# EAGLE design rpilink222 (EAGLE 7.1.0)
Raspberry Pi Link Adaptor v2.22, Copyright (C) 2014 Hessel Schut
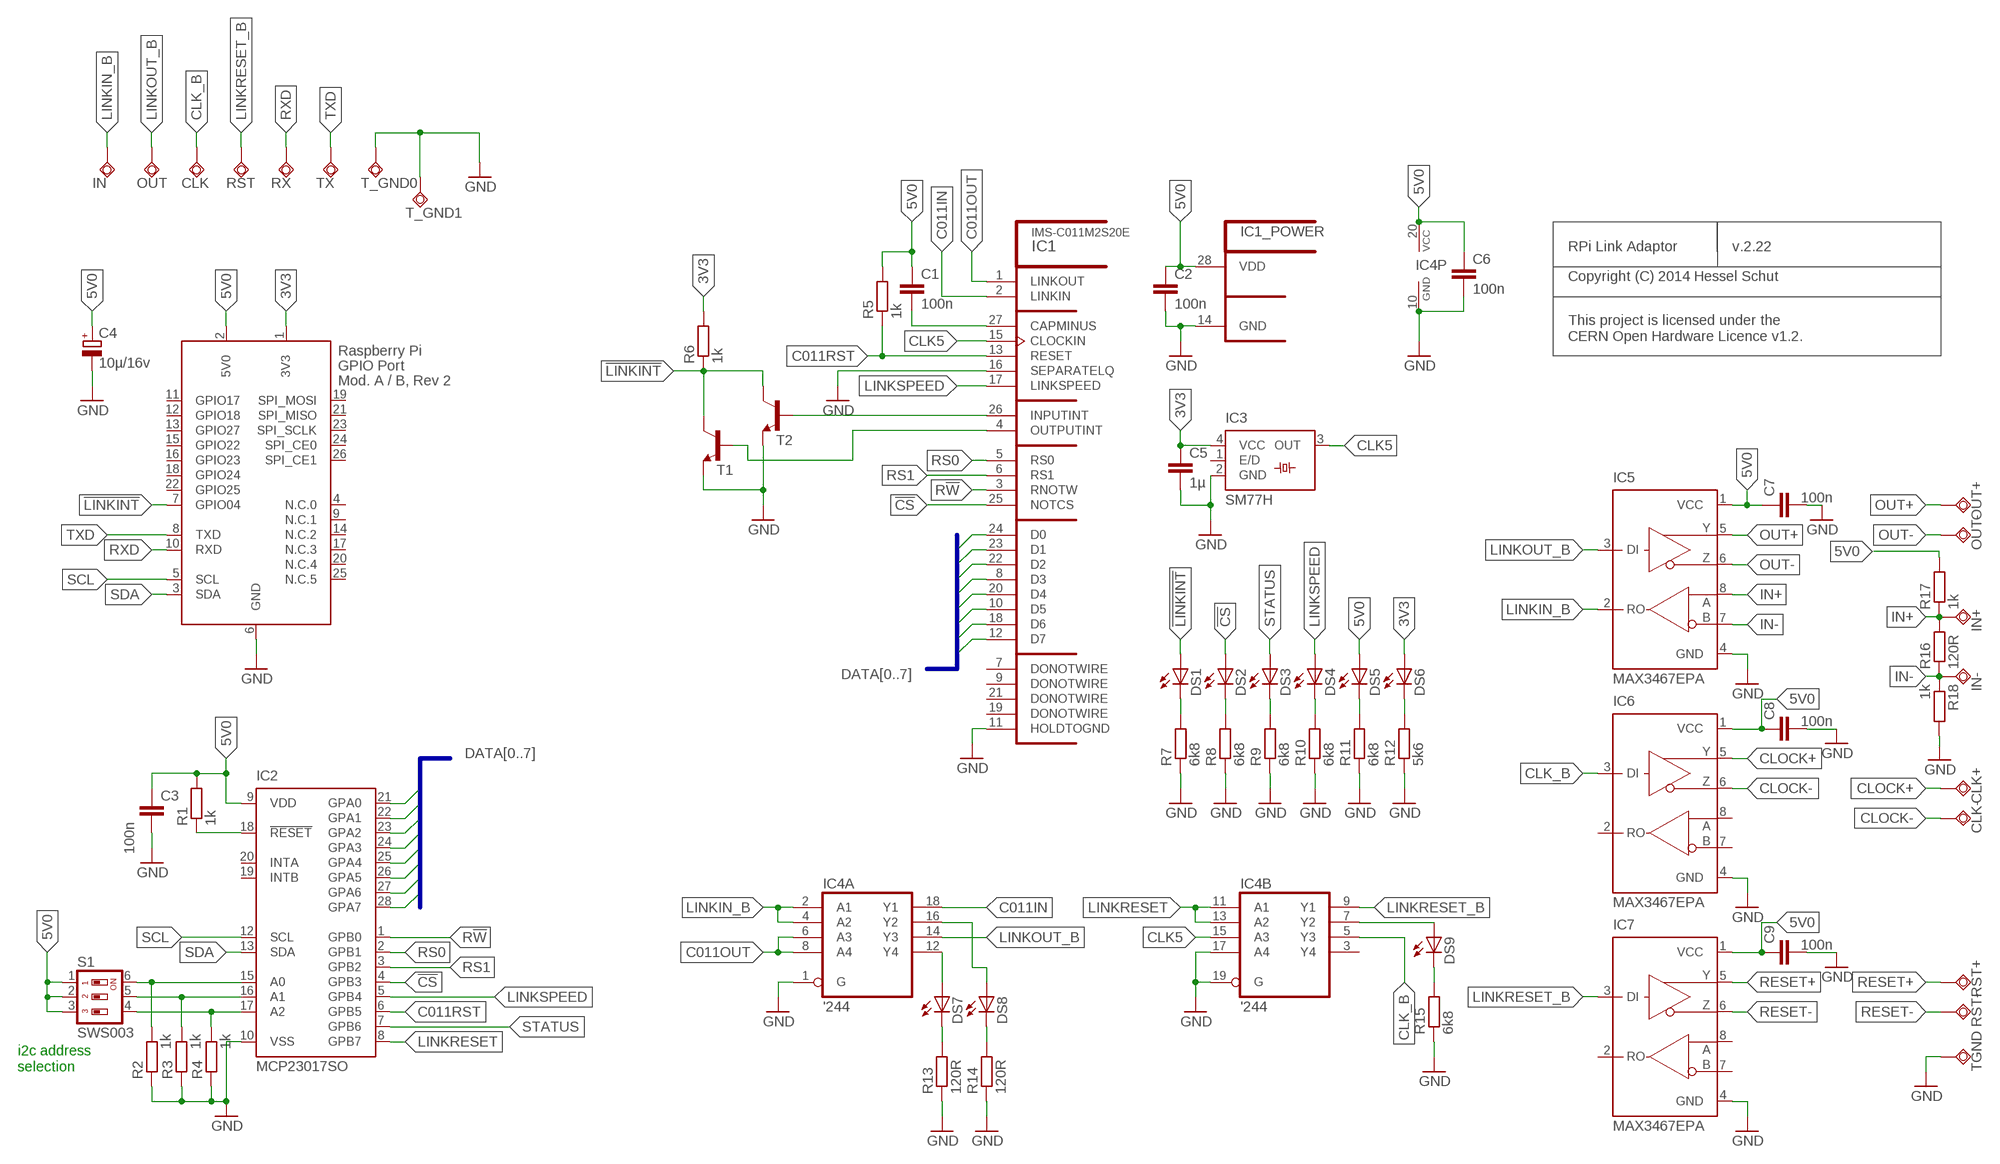
[diagram p0: schematic, sheet 1]

## Parts
C1  100n  C-EUC0805  [C0805]
C2  100n  C-EUC0805  [C0805]
C3  100n  C-EUC0805  [C0805]
C4  10µ/16v  CPOL-EUC/6032-28R  [C/6032-28R]
C5  1µ  C-EUC0805  [C0805]
C6  100n  C-EUC0805  [C0805]
C7  100n  C-EUC0805  [C0805]
C8  100n  C-EUC0805  [C0805]
C9  100n  C-EUC0805  [C0805]
CLK  TPSQTP20SQ  [TP20SQ]
CLK+  TPSQTP20SQ  [TP20SQ]
CLK-  TPSQTP20SQ  [TP20SQ]
DS1  LEDCHIP-LED0603  [CHIP-LED0603]
DS2  LEDCHIP-LED0603  [CHIP-LED0603]
DS3  LEDCHIP-LED0603  [CHIP-LED0603]
DS4  LEDCHIP-LED0603  [CHIP-LED0603]
DS5  LEDCHIP-LED0603  [CHIP-LED0603]
DS6  LEDCHIP-LED0603  [CHIP-LED0603]
DS7  LEDCHIP-LED0603  [CHIP-LED0603]
DS8  LEDCHIP-LED0603  [CHIP-LED0603]
DS9  LEDCHIP-LED0603  [CHIP-LED0603]
IC1  IMS-C011M2S20E  [SOJ28-3]
IC2  MCP23017SO  [SO28W]
IC3  SM77H  [SM77H]
IC4  '244  74AC244DW  [SO20W]
IC5  MAX3467EPA  [SO08]
IC6  MAX3467EPA  [SO08]
IC7  MAX3467EPA  [SO08]
IN  TPSQTP20SQ  [TP20SQ]
IN+  TPSQTP20SQ  [TP20SQ]
IN-  TPSQTP20SQ  [TP20SQ]
OUT  TPSQTP20SQ  [TP20SQ]
OUT+  TPSQTP20SQ  [TP20SQ]
OUT-  TPSQTP20SQ  [TP20SQ]
R1  1k  R-EU_R0603  [R0603]
R2  1k  R-EU_R0603  [R0603]
R3  1k  R-EU_R0603  [R0603]
R4  1k  R-EU_R0603  [R0603]
R5  1k  R-EU_R0603  [R0603]
R6  1k  R-EU_R0603  [R0603]
R7  6k8  R-EU_R0603  [R0603]
R8  6k8  R-EU_R0603  [R0603]
R9  6k8  R-EU_R0603  [R0603]
R10  6k8  R-EU_R0603  [R0603]
R11  6k8  R-EU_R0603  [R0603]
R12  5k6  R-EU_R0603  [R0603]
R13  120R  R-EU_R0603  [R0603]
R14  120R  R-EU_R0603  [R0603]
R15  6k8  R-EU_R0603  [R0603]
R16  120R  R-EU_R0603  [R0603]
R17  1k  R-EU_R0603  [R0603]
R18  1k  R-EU_R0603  [R0603]
RST  TPSQTP20SQ  [TP20SQ]
RST+  TPSQTP20SQ  [TP20SQ]
RST-  TPSQTP20SQ  [TP20SQ]
RX  TPSQTP20SQ  [TP20SQ]
S1  SWS003  [SMS-003]
T1  BC808-NPN-SOT23-BEC  [SOT23-BEC]
T2  BC808-NPN-SOT23-BEC  [SOT23-BEC]
T_GND0  TPSQTP20SQ  [TP20SQ]
T_GND1  TPSQTP20SQ  [TP20SQ]
TGND  TPSQTP20SQ  [TP20SQ]
TX  TPSQTP20SQ  [TP20SQ]
X1  RASPI_BOARD_AB_E2P  [RASPI_BOARD_AB_EDGES_2DRILL_PAD]

## Nets
3V3: C5.1 DS6.A IC3.4(VCC) R6.2 X1.1(3V3)
5V0: C1.1 C2.1 C3.1 C4.+ C6.1 C7.1 C8.1 C9.1 DS5.A IC1.28(VDD) IC2.9(VDD) IC4.20(P:VCC) IC5.1(VCC) IC6.1(VCC) IC7.1(VCC) R1.2 R5.2 R17.2 S1.1 S1.2 S1.3 X1.2(5V0)
!CS: DS2.A IC1.25(NOTCS) IC2.4(GPB3)
!LINKINT: DS1.A R6.1 T1.C T2.C X1.7(GPIO04)
C011IN: IC1.2(LINKIN) IC4.18(A:Y1)
C011OUT: IC1.1(LINKOUT) IC4.6(A:A3) IC4.8(A:A4)
C011RST: IC1.13(RESET) IC2.6(GPB5) R5.1
CLK5: IC1.15(CLOCKIN) IC3.3(OUT) IC4.15(B:A3)
CLK_B: CLK.TP IC4.5(B:Y3) IC6.3(DI)
CLOCK+: CLK+.TP IC6.5(Y)
CLOCK-: CLK-.TP IC6.6(Z)
DATA0: IC1.24(D0) IC2.21(GPA0)
DATA1: IC1.23(D1) IC2.22(GPA1)
DATA2: IC1.22(D2) IC2.23(GPA2)
DATA3: IC1.8(D3) IC2.24(GPA3)
DATA4: IC1.20(D4) IC2.25(GPA4)
DATA5: IC1.10(D5) IC2.26(GPA5)
DATA6: IC1.18(D6) IC2.27(GPA6)
DATA7: IC1.12(D7) IC2.28(GPA7)
GND: C2.2 C3.2 C4.- C5.2 C6.2 C7.2 C8.2 C9.2 IC1.11(HOLDTOGND) IC1.14(GND) IC1.16(SEPARATELQ) IC2.10(VSS) IC3.2(GND) IC4.1(A:G) IC4.10(P:GND) IC4.17(B:A4) IC4.19(B:G) IC5.4(GND) IC6.4(GND) IC7.4(GND) R2.1 R3.1 R4.1 R7.1 R8.1 R9.1 R10.1 R11.1 R12.1 R13.1 R14.1 R15.1 R18.2 T1.E T2.E T_GND0.TP T_GND1.TP TGND.TP X1.6(GND)
IN+: IC5.8(A) IN+.TP R16.2 R17.1
IN-: IC5.7(B) IN-.TP R16.1 R18.1
LINKIN_B: IC4.2(A:A1) IC4.4(A:A2) IC5.2(RO) IN.TP
LINKOUT_B: IC4.14(A:Y3) IC5.3(DI) OUT.TP
LINKRESET: IC2.8(GPB7) IC4.11(B:A1) IC4.13(B:A2)
LINKRESET_B: IC4.9(B:Y1) IC7.3(DI) RST.TP
LINKSPEED: DS4.A IC1.17(LINKSPEED) IC2.5(GPB4)
N$1: IC2.18(!RESET) R1.1
N$2: IC2.15(A0) R2.2 S1.6
N$3: C1.2 IC1.27(CAPMINUS)
N$4: IC2.16(A1) R3.2 S1.5
N$5: IC2.17(A2) R4.2 S1.4
N$6: IC1.26(INPUTINT) T2.B
N$7: IC1.4(OUTPUTINT) T1.B
N$8: DS7.C R13.2
N$9: DS8.C R14.2
N$10: DS7.A IC4.12(A:Y4)
N$11: DS1.C R7.2
N$12: DS2.C R8.2
N$13: DS3.C R9.2
N$14: DS4.C R10.2
N$15: DS5.C R11.2
N$16: DS6.C R12.2
N$17: DS8.A IC4.16(A:Y2)
N$19: DS9.A IC4.7(B:Y2)
N$20: DS9.C R15.2
OUT+: IC5.5(Y) OUT+.TP
OUT-: IC5.6(Z) OUT-.TP
R!W: IC1.3(RNOTW) IC2.1(GPB0)
RESET+: IC7.5(Y) RST+.TP
RESET-: IC7.6(Z) RST-.TP
RS0: IC1.5(RS0) IC2.2(GPB1)
RS1: IC1.6(RS1) IC2.3(GPB2)
RXD: RX.TP X1.10(RXD)
SCL: IC2.12(SCL) X1.5(SCL)
SDA: IC2.13(SDA) X1.3(SDA)
STATUS: DS3.A IC2.7(GPB6)
TXD: TX.TP X1.8(TXD)
Unconnected: IC1.7(DONOTWIRE) IC1.9(DONOTWIRE) IC1.19(DONOTWIRE) IC1.21(DONOTWIRE) IC2.19(INTB) IC2.20(INTA) IC3.1(E/D) IC4.3(B:Y4) IC6.2(RO) IC6.7(B) IC6.8(A) IC7.2(RO) IC7.7(B) IC7.8(A) X1.4(N.C.0) X1.9(N.C.1) X1.11(GPIO17) X1.12(GPIO18) X1.13(GPIO27) X1.14(N.C.2) X1.15(GPIO22) X1.16(GPIO23) X1.17(N.C.3) X1.18(GPIO24) X1.19(SPI_MOSI) X1.20(N.C.4) X1.21(SPI_MISO) X1.22(GPIO25) X1.23(SPI_SCLK) X1.24(SPI_CE0) X1.25(N.C.5) X1.26(SPI_CE1)

## Buses
DATA[0..7]

## Notes on the sheet
- RPi Link Adaptor | v.2.22
- Copyright (C) 2014 Hessel Schut
- This project is licensed under the 
  CERN Open Hardware Licence v1.2.
- i2c address
  selection

## Library data of the parts
C1-C3 C5-C9 = rcl:C-EU: CAPACITOR, European symbol
C4 = rcl:CPOL-EU: POLARIZED CAPACITOR, European symbol
CLK CLK+ CLK- IN IN+ IN- OUT OUT+ OUT- RST RST+ RST- RX T_GND0 T_GND1 TGND TX = testpad:TPSQ: Test pad
DS1-DS9 = led:LED: LED OSRAM: - CHIPLED LG R971, LG N971, LY N971, LG Q971, LY Q971, LO R971, LY R971 LH N974, LH R974 LS Q976, LO Q976, LY Q976 LO Q996 - Hyper CHIPLED LW Q18S LB Q993, LB Q99A, LB R99A - SideLED LS A670, LO A670, LY A670, LG A670, LP A670 LB A673, LV A673, LT A673, LW A673 LH A674 LY A675 LS A676, LA A676, LO A676, LY A676, LW A676 LS A679, LY A679, LG A679 - Hyper Micro SIDELED® LS Y876, LA Y876, LO Y876, LY Y876 LT Y87S - SmartLED LW L88C, LW L88S LB L89C, LB L89S, LG L890 LS L89K, LO L89K, LY L89K LS L896, LA L896, LO L896, LY L896 - TOPLED LS T670, LO T670, LY T670, LG T670, LP T670 LSG T670, LSP T670, LSY T670, LOP T670, LYG T670 LG T671, LOG T671, LSG T671 LB T673, LV T673, LT T673, LW T673 LH T674 LS T676, LA T676, LO T676, LY T676, LB T676, LH T676, LSB T676, LW T676 LB T67C, LV T67C, LT T67C, LS T67K, LO T67K, LY T67K, LW E67C LS E67B, LA E67B, LO E67B, LY E67B, LB E67C, LV E67C, LT E67C LW T67C LS T679, LY T679, LG T679 LS T770, LO T770, LY T770, LG T770, LP T770 LB T773, LV T773, LT T773, LW T773 LH T774 LS E675, LA E675, LY E675, LS T675 LS T776, LA T776, LO T776, LY T776, LB T776 LHGB T686 LT T68C, LB T68C - Hyper Mini TOPLED® LB M676 - Mini TOPLED Santana® LG M470 LS M47K, LO M47K, LY M47K Source: http://www.osram.convergy.de LUXEON: - LUMILED® LXK2-PW12-R00, LXK2-PW12-S00, LXK2-PW14-U00, LXK2-PW14-V00 LXK2-PM12-R00, LXK2-PM12-S00, LXK2-PM14-U00 LXK2-PE12-Q00, LXK2-PE12-R00, LXK2-PE12-S00, LXK2-PE14-T00, LXK2-PE14-U00 LXK2-PB12-K00, LXK2-PB12-L00, LXK2-PB12-M00, LXK2-PB14-N00, LXK2-PB14-P00, LXK2-PB14-Q00 LXK2-PR12-L00, LXK2-PR12-M00, LXK2-PR14-Q00, LXK2-PR14-R00 LXK2-PD12-Q00, LXK2-PD12-R00, LXK2-PD12-S00 LXK2-PH12-R00, LXK2-PH12-S00 LXK2-PL12-P00, LXK2-PL12-Q00, LXK2-PL12-R00 Source: www.luxeon.com KINGBRIGHT: KA-3528ASYC Source: www.kingbright.com
IC1 = Transputers:IMS-C011M2: C011 peripheral mode 2 INMOS link adaptor in operation mode 2. Source: The Transputer Databook 1992 INMOS/SGS-Thomson Arto Kyyhkynen, artoky@dlc.fi
IC2 = microchip:MCP23017: http://ww1.microchip.com/downloads/en/DeviceDoc/21952a.pdf Source: http://ww1.microchip.com/downloads/en/DeviceDoc/21952a.pdf; MF: MICROCHIP; MPN: MCP23017-E/SO; OC_FARNELL: 1332087; OC_NEWARK: 31K2958
IC3 = crystal:SM77H: 3.3V CMOS Clock Oscillator Source: www.pletronics.com .. sm77h%203.3v.pdf; OC_FARNELL: unknown; OC_NEWARK: unknown
IC4 = 74xx-eu:74*244: Octal BUFFER and LINE DRIVER, 3-state
IC5-IC7 = maxim:MAX3467*: +5V, Fail-Safe, 40Mbps, Profibus RS-485/RS-422 Transceivers Source: MAX3465-MAX3469.pdf; OC_FARNELL: unknown; OC_NEWARK: unknown
R1-R18 = rcl:R-EU_: RESISTOR, European symbol
S1 = smd-special:SWS003: SMD Dip Switch 3 pol.
T1 T2 = transistor:*-NPN-: NPN Transistror BF959 corrected 2008.03.06
X1 = raspberrypi_bastelstube_v13:RASPI_BOARD_AB: Raspberry Pi GPIO connector with markings for the outer dimensions of the Raspberry Pi board model A or B with different sets of drill holes or mounting pads for model B Revision 2.0

## Board
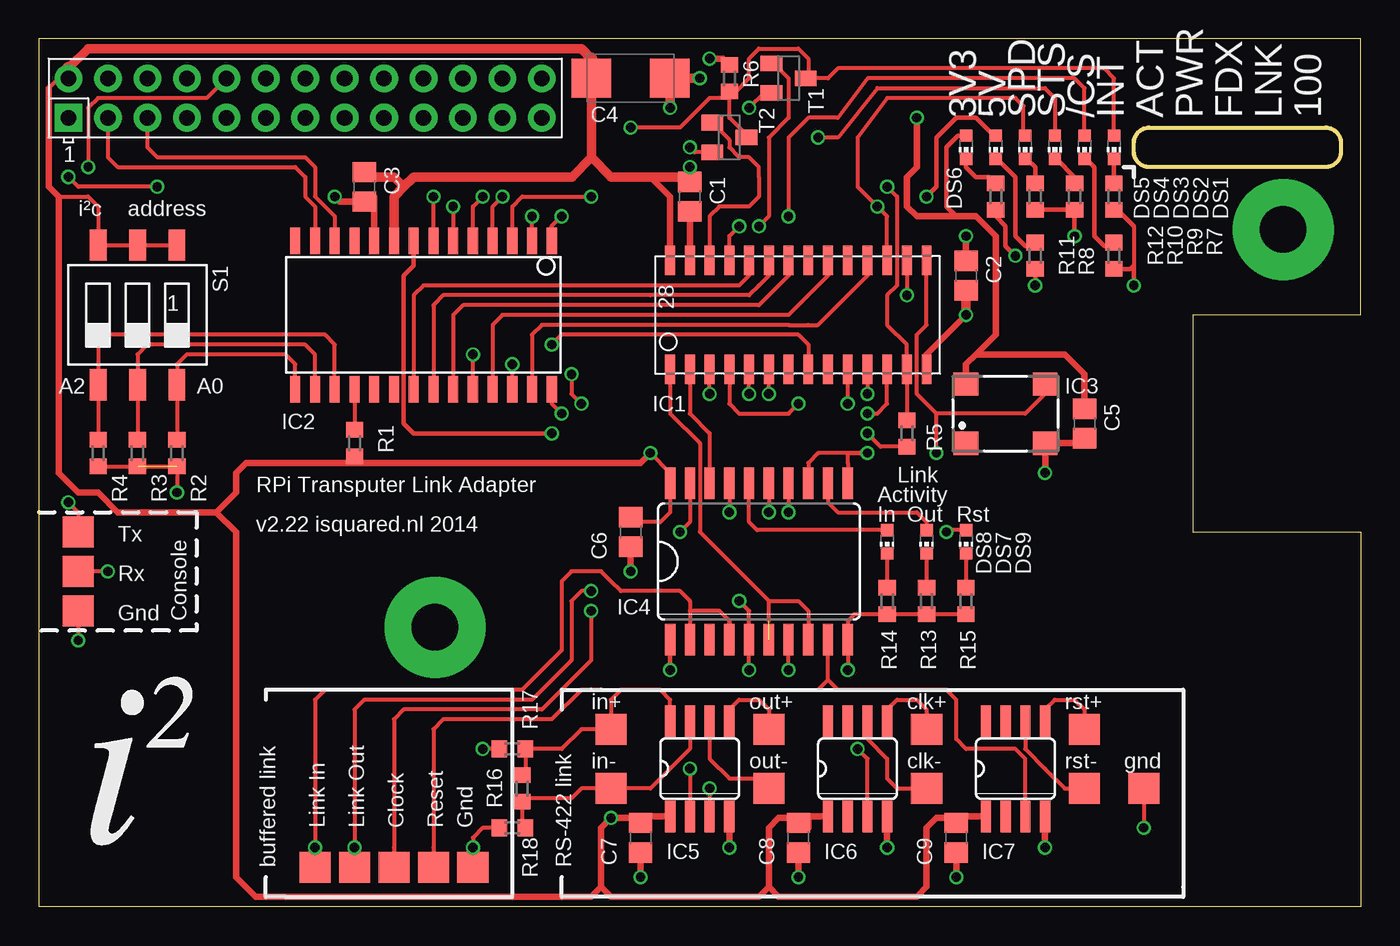
[diagram p1: board, top side]
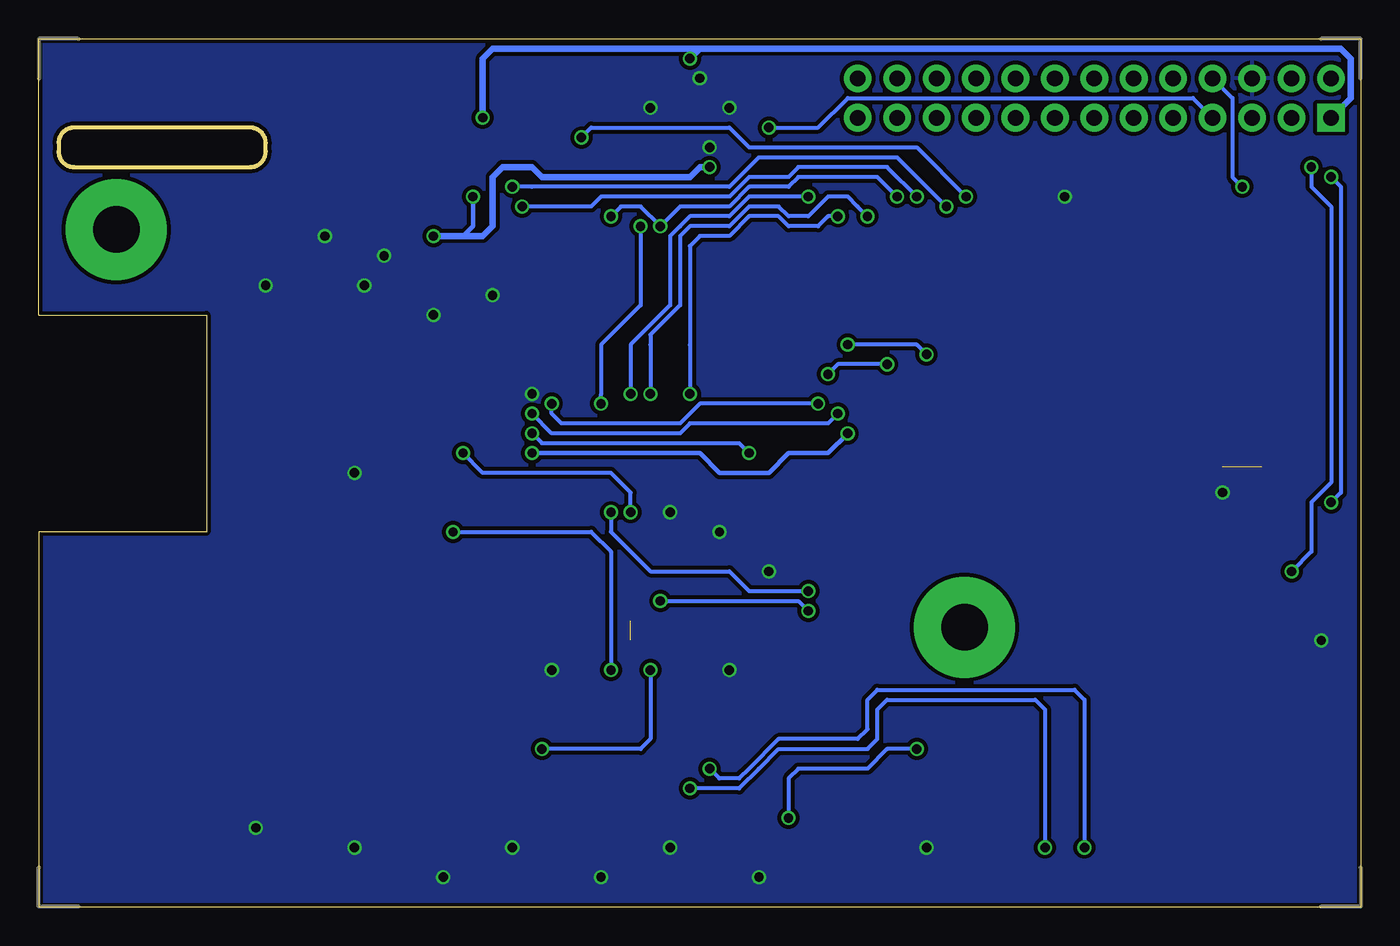
[diagram p2: board, bottom side, seen from below]

Size 85.09 x 55.88 mm. Coordinates in mm from the lower left corner, seen from the top.
Outline: 0,55.87 0,0 85.09,0 85.09,24.13 84.45,24.13 74.3,24.13 74.3,38.1 85.09,38.1 85.09,55.88 0,55.88
Outline: 71.48,50.16 82.82,50.16 arc-90 83.82,49.16 83.82,48.62 arc-90 82.82,47.62 71.48,47.62 arc-90 70.48,48.62 70.48,49.16 arc-90 71.48,50.16
Copper layers (1*16): Top 0.035mm / dielectric 1.5mm / Bottom 0.035mm
Design rules "dirt_cheap_dirty_boards.v1": minimum track width 5mil, minimum drill 12mil, track to track 5mil, track to pad 5mil, pad to pad 5mil, via to via 5mil, smd to smd 0mil, copper to edge 10mil, drill to drill 10mil, minimum pad ring 10mil, minimum via ring 6mil, stop-mask expansion 2mil, vias tented up to drill 25mil, thermal gap 10mil

### Footprints (pad centres in the part's own frame; a part is rotated, then mirrored left to right if it is on the bottom)
C0805 = smd 1.3 x 1.5: 1 -0.95,0; 2 0.95,0
C/6032-28R = smd 2.55 x 2.5: + 2.525,0; - -2.525,0
TP20SQ = smd 2 x 2: TP 0,0
CHIP-LED0603 = smd 0.8 x 0.8: A 0,-0.75; C 0,0.75
SOJ28-3 = smd 0.635 x 1.905: 1 -7.62,-3.505; 2 -6.35,-3.505; 3 -5.08,-3.505; 4 -3.81,-3.505; 5 -2.54,-3.505; 6 -1.27,-3.505; 7 0,-3.505; 8 1.27,-3.505; 9 2.54,-3.505; 10 3.81,-3.505; 11 5.08,-3.505; 12 6.35,-3.505; 13 7.62,-3.505; 14 8.89,-3.505; 15 8.89,3.505; 16 7.62,3.505; 17 6.35,3.505; 18 5.08,3.505; 19 3.81,3.505; 20 2.54,3.505; 21 1.27,3.505; 22 0,3.505; 23 -1.27,3.505; 24 -2.54,3.505; 25 -3.81,3.505; 26 -5.08,3.505; 27 -6.35,3.505; 28 -7.62,3.505
SO28W = smd 0.65 x 1.7: 1 -7.62,-4.78; 2 -6.35,-4.78; 3 -5.08,-4.78; 4 -3.81,-4.78; 5 -2.54,-4.78; 6 -1.27,-4.78; 7 0,-4.78; 8 1.27,-4.78; 9 2.54,-4.78; 10 3.81,-4.78; 11 5.08,-4.78; 12 6.35,-4.78; 13 7.62,-4.78; 14 8.89,-4.78; 15 8.89,4.78; 16 7.62,4.78; 17 6.35,4.78; 18 5.08,4.78; 19 3.81,4.78; 20 2.54,4.78; 21 1.27,4.78; 22 0,4.78; 23 -1.27,4.78; 24 -2.54,4.78; 25 -3.81,4.78; 26 -5.08,4.78; 27 -6.35,4.78; 28 -7.62,4.78
SM77H = smd 1.6 x 1.5: 1 -2.55,-1.9; 2 2.55,-1.9; 3 2.55,1.9; 4 -2.55,1.9
SO20W = smd 0.66 x 2.032: 1 -5.715,-5.029; 2 -4.445,-5.029; 3 -3.175,-5.029; 4 -1.905,-5.029; 5 -0.635,-5.029; 6 0.635,-5.029; 7 1.905,-5.029; 8 3.175,-5.029; 9 4.445,-5.029; 10 5.715,-5.029; 11 5.715,5.029; 12 4.445,5.029; 13 3.175,5.029; 14 1.905,5.029; 15 0.635,5.029; 16 -0.635,5.029; 17 -1.905,5.029; 18 -3.175,5.029; 19 -4.445,5.029; 20 -5.715,5.029
SO08 = smd 0.66 x 2.032: 1 -1.905,-3.073; 2 -0.635,-3.073; 3 0.635,-3.073; 4 1.905,-3.073; 5 1.905,3.073; 6 0.635,3.073; 7 -0.635,3.073; 8 -1.905,3.073
R0603 = smd 1 x 1.1: 1 -0.85,0; 2 0.85,0
SMS-003 = smd 1.092 x 2.007: 1 -2.54,-4.496; 2 0,-4.496; 3 2.54,-4.496; 4 2.54,4.496; 5 0,4.496; 6 -2.54,4.496
SOT23-BEC = smd 1 x 1.4: B -0.95,-1.1; C 0,1.1; E 0.95,-1.1
RASPI_BOARD_AB_EDGES_2DRILL_PAD = drill 1 pad 1.778 square: 1 1.905,50.8 | drill 1 pad 1.778: 2 1.905,53.34; 3 4.445,50.8; 4 4.445,53.34; 5 6.985,50.8; 6 6.985,53.34; 7 9.525,50.8; 8 9.525,53.34; 9 12.065,50.8; 10 12.065,53.34; 11 14.605,50.8; 12 14.605,53.34; 13 17.145,50.8; 14 17.145,53.34; 15 19.685,50.8; 16 19.685,53.34; 17 22.225,50.8; 18 22.225,53.34; 19 24.765,50.8; 20 24.765,53.34; 21 27.305,50.8; 22 27.305,53.34; 23 29.845,50.8; 24 29.845,53.34; 25 32.385,50.8; 26 32.385,53.34 | drill 3 pad 6.5: DRILL_1 25.5,18; DRILL_2 80.1,43.6

### Placement (x,y rotation side)
C1  41.91,45.72 270 top
C2  59.69,40.64 270 top
C3  20.95,46.35 270 top
C4  38.1,53.34 180 top
C5  67.31,31.11 270 top
C6  38.1,24.13 270 top
C7  38.73,4.45 270 top
C8  48.9,4.45 270 top
C9  59.05,4.45 270 top
CLK  22.86,2.54 90 top
CLK+  57.15,11.43 0 top
CLK-  57.15,7.62 0 top
DS1  69.22,48.9 180 top
DS2  67.31,48.9 180 top
DS3  65.41,48.9 180 top
DS4  63.5,48.9 180 top
DS5  61.59,48.9 180 top
DS6  59.69,48.9 180 top
DS7  57.15,23.5 180 top
DS8  54.61,23.5 180 top
DS9  59.69,23.5 180 top
IC1  48.26,38.1 0 top
IC2  25.4,38.1 180 top
IC3  62.23,31.75 0 top
IC4  46.35,22.23 0 top
IC5  42.55,8.89 0 top
IC6  52.7,8.89 0 top
IC7  62.87,8.89 0 top
IN  17.78,2.54 90 top
IN+  36.83,11.43 0 top
IN-  36.83,7.62 0 top
OUT  20.32,2.54 90 top
OUT+  46.99,11.43 0 top
OUT-  46.99,7.62 0 top
R1  20.32,29.84 270 top
R2  8.89,29.21 90 top
R3  6.35,29.21 90 top
R4  3.81,29.21 90 top
R5  55.88,30.48 270 top
R6  44.45,53.34 90 top
R7  69.22,45.72 90 top
R8  69.22,41.91 90 top
R9  66.67,45.72 90 top
R10  64.14,45.72 90 top
R11  64.14,41.91 90 top
R12  61.59,45.72 90 top
R13  57.15,19.68 90 top
R14  54.61,19.68 90 top
R15  59.69,19.68 90 top
R16  31.11,7.62 90 top
R17  30.48,10.16 180 top
R18  30.48,5.08 180 top
RST  25.4,2.54 90 top
RST+  67.31,11.43 0 top
RST-  67.31,7.62 0 top
RX  2.54,21.59 270 top
S1  6.35,38.1 180 top
T1  48.26,53.34 270 top
T2  44.45,49.53 270 top
T_GND0  27.94,2.54 90 top
T_GND1  2.54,19.05 270 top
TGND  71.12,7.62 0 top
TX  2.54,24.13 270 top
U$1  [LOGOWOBLRG]  1.27,3.81 0 top
X1  0,0 0 top

### Tracks (layer width: path | path; a pad name or v marks a point on that pad's centre or on a via)
3V3  (via drill 0.6)
  Top 0.305: DS6.A 59.17,49.65 58.42,48.9 58.42,45.09 59.05,44.45
  Top 0.406: v43.18,54.61 44.03,54.61 R6.2 | C5.1 67.31,34.29 66.04,35.56 60.33,35.56 | 60.33,35.56 59.69,34.92 | 59.69,34.92 IC3.4 59.68,34.91 59.69,34.92 | 60.33,35.56 61.59,36.83 61.59,43.18 60.33,44.45 59.05,44.45 56.52,44.45 55.88,45.09 55.88,46.99 56.52,47.62 v56.52,50.8
  Bottom 0.406: X1.1 0.64,52.07 0.64,54.61 1.27,55.24 42.55,55.24 | 42.55,55.24 v43.18,54.61 | 42.55,55.24 55.88,55.24 56.52,54.61 v56.52,50.8
5V0  (via drill 0.6)
  Top 0.254: S1.3 S1.2 S1.1 | X1.2 1.27,53.34 0.64,52.7 | 3.76,42.55 S1.3 | 1.27,45.72 3.17,45.72 3.81,45.09 S1.3 | v39.37,29.21 40.64,27.94 IC4.20 40.64,25.4 40.01,24.77 38.41,24.77 C6.1 | R5.2 54.19,29.63 v53.34,30.48 | R1.2 20.32,29.21 20.32,28.57 | R17.2 v28.57,10.16
  Top 0.305: DS5.A 61.48,49.65 60.33,50.8 59.05,50.8 57.78,49.53 57.78,46.35 v57.15,45.72
  Top 0.406: 0.64,52.7 0.64,46.35 1.27,45.72 1.27,27.94 2.54,26.67 3.81,26.67 5.08,25.4 10.16,25.4 11.43,25.4 | v59.69,43.18 C2.1 | IC1.28 40.64,45.72 39.37,46.99 | 42.23,46.67 C1.1 v41.91,47.62 | 11.43,25.4 12.7,26.67 12.7,27.94 13.34,28.57 20.32,28.57 38.73,28.57 v39.37,29.21 | IC5.1 39.16,5.82 C7.1 38.73,5.71 v36.83,5.71 36.2,5.08 36.2,1.27 | IC6.1 49.32,5.82 | 49.32,5.82 C8.1 | 11.43,25.4 12.7,24.13 12.7,1.91 13.97,0.64 35.56,0.64 36.2,1.27 | 36.2,1.27 36.83,0.64 46.35,0.64 46.99,1.27 | 46.99,1.27 47.62,0.64 56.52,0.64 57.15,1.27 57.15,5.08 57.78,5.71 59.05,5.71 C9.1 59.48,5.82 IC7.1 | 46.99,1.27 46.99,5.08 47.62,5.71 49.53,5.71 49.53,5.08 49.32,5.29 49.32,5.82
  Top 0.61: 1.91,53.98 3.17,55.24 34.92,55.24 35.56,54.61 | C4.+ 35.58,48.24 | 35.58,48.24 36.83,46.99 39.37,46.99 41.59,46.99 C1.1 | IC2.9 22.86,45.72 23.5,46.35 | 23.5,46.35 24.13,46.99 34.32,46.99 35.58,48.24 | 23.5,46.35 22.86,46.99 21.27,46.99 C3.1
  Top 0.813: X1.2 1.91,53.98 | 35.56,54.61 35.56,53.35 C4.+
  Bottom 0.254: v53.34,30.48 52.7,29.84 40.01,29.84 v39.37,29.21 | v36.83,5.71 36.83,8.26 36.2,8.89 31.75,8.89 30.48,10.16 v28.57,10.16
  Bottom 0.305: v57.15,45.72 57.15,43.81 57.78,43.18
  Bottom 0.406: v59.69,43.18 57.78,43.18 56.52,43.18 55.88,43.81 55.88,46.99 55.24,47.62 53.34,47.62 52.7,46.99 43.18,46.99 42.55,47.62 v41.91,47.62
!CS  (via drill 0.6)
  Top 0.254: IC2.4 29.21,45.09 v29.84,45.72 | IC1.25 44.45,43.18 v45.09,43.81 | v48.26,44.45 48.26,49.53 49.53,50.8 51.44,50.8 53.34,53.34 66.67,53.34 67.31,52.7 DS2.A
  Bottom 0.254: v29.84,45.72 31.11,46.99 36.2,46.99 36.83,46.35 39.37,46.35 40.64,45.09 43.81,45.09 v45.09,43.81 46.35,45.09 47.62,45.09 v48.26,44.45
!LINKINT  (via drill 0.6)
  Top 0.254: T2.C 45.55,49.7 44.45,50.8 44.45,52.07 | 44.45,52.07 R6.1 44.87,52.49 45.72,53.34 45.72,54.61 46.35,55.24 48.9,55.24 49.53,54.61 49.53,53.51 T1.C | 44.45,52.07 43.18,52.07 41.27,50.16 v38.1,50.16 | DS1.A 69.22,53.34 68.58,53.98 51.44,53.98 50.8,53.34 T1.C | 49.53,53.17 T1.C
  Bottom 0.254: v38.1,50.16 34.92,50.16 33.02,52.07 10.79,52.07 X1.7
C011IN
  Top 0.254: IC1.2 41.91,31.75 43.18,30.48 IC4.18
C011OUT  (1 unrouted)
  Top 0.254: IC1.1 40.64,31.75 42.55,29.84 42.55,24.13 46.99,19.68 | 46.99,18.41 46.99,19.68 | 46.99,19.68 48.9,19.68 49.53,19.05 IC4.8
C011RST  (via drill 0.6)
  Top 0.254: R5.1 IC1.13 55.88,36.2 54.61,37.47 54.61,39.37 55.24,40.01 55.24,45.72 v54.61,46.35 | v26.67,45.09 IC2.6
  Bottom 0.254: v26.67,45.09 29.84,48.26 38.73,48.26 40.64,46.35 v54.61,46.35 53.34,46.35
CLK5  (via drill 0.6)
  Top 0.254: IC3.3 64.78,33.03 63.5,31.75 57.78,31.75 | IC1.15 57.15,37.47 56.52,36.83 56.52,33.02 57.47,32.07 57.78,31.75 | IC4.15 v46.99,25.4 | v57.78,29.21 57.78,31.75
  Bottom 0.254: v46.99,25.4 46.99,26.67 48.26,27.94 56.52,27.94 v57.78,29.21
CLK_B  (via drill 0.6)
  Top 0.254: IC4.5 45.72,17.78 | 45.72,17.78 45.72,19.05 v45.09,19.68 | v35.56,19.05 35.56,15.88 34.92,15.24 32.38,12.7 23.5,12.7 22.86,12.06 22.86,3.81 CLK.TP | IC6.3 53.34,9.53 v52.7,10.16 | v45.72,15.24 45.72,17.78
  Bottom 0.254: v45.09,19.68 36.2,19.68 v35.56,19.05 | v45.72,15.24 45.72,10.79 46.35,10.16 v52.7,10.16
CLOCK+
  Top 0.254: IC6.5 54.61,12.7 55.24,13.34 56.52,13.34 57.15,12.7 CLK+.TP
CLOCK-
  Top 0.254: IC6.6 53.34,10.79 54.61,9.53 54.61,8.26 55.24,7.62 CLK-.TP
DATA0
  Top 0.254: IC1.24 45.72,40.64 45.09,40.01 38.73,40.01 24.77,40.01 24.13,39.37 IC2.21
DATA1
  Top 0.254: IC1.23 46.99,40.64 46.35,40.01 45.72,39.37 39.37,39.37 26.04,39.37 25.4,38.73 IC2.22
DATA2
  Top 0.254: IC1.22 48.26,40.64 46.35,38.73 40.01,38.73 27.3,38.73 26.67,38.1 IC2.23
DATA3  (via drill 0.6)
  Top 0.254: IC2.24 v27.94,35.56 | IC1.8 49.53,36.2 48.9,36.83 33.66,36.83 v33.02,36.2
  Bottom 0.254: v27.94,35.56 28.57,36.2 v33.02,36.2
DATA4
  Top 0.254: IC1.20 50.8,40.64 49.53,39.37 48.26,38.1 46.99,38.1 40.64,38.1 29.84,38.1 29.21,37.47 IC2.25
DATA5  (via drill 0.6)
  Top 0.254: IC2.26 v30.48,34.92 | v34.29,34.29 34.29,33.02 v34.92,32.38 | v52.07,32.38 IC1.10
  Bottom 0.254: v30.48,34.92 33.66,34.92 v34.29,34.29 | v34.92,32.38 42.55,32.38 43.18,31.75 43.81,31.11 51.44,31.11 52.07,31.75 v52.07,32.38
DATA6
  Top 0.254: IC1.18 53.34,40.64 50.16,37.47 49.53,37.47 48.26,37.47 46.99,37.47 41.27,37.47 32.38,37.47 31.75,36.83 IC2.27
DATA7  (via drill 0.6)
  Top 0.254: IC2.28 33.02,32.38 v33.66,31.75 | v53.34,31.75 53.98,31.75 54.61,32.38 IC1.12
  Bottom 0.254: v33.66,31.75 34.29,31.11 43.18,31.11 43.81,30.48 52.07,30.48 v53.34,31.75
GND  (via drill 0.6)  (1 unrouted)
  Top 0.254: R4.1 R2.1 v8.89,26.67 | T2.E 42.23,48.58 v41.91,48.9 | T1.E 46.67,52.39 v45.72,51.44 | IC1.11 v53.34,33.02 | IC1.16 v55.88,39.37 | v52.07,15.24 IC4.10 52.07,18.41 52.49,18.84 R14.1 R13.1 R15.1 | T_GND1.TP v2.54,17.14 | T_GND0.TP v27.94,3.81 27.94,4.45 28.57,5.08 R18.2 | 70.48,43.81 70.48,41.27 | IC4.19 41.91,24.77 v41.27,24.13 | 57.15,35.56 IC1.14 | TGND.TP v71.12,5.08 | IC4.17 v44.45,25.4
  Top 0.305: R10.1 R9.1 v66.67,43.18 | R7.1 69.43,44.87 70.48,43.81 | v70.48,40.01 70.48,41.27 70.27,41.06 R8.1 | R11.1 v64.14,40.01 | R12.1 61.59,44.45 62.23,43.81 62.23,42.55 v62.87,41.91 | IC4.1 v40.64,15.24
  Top 0.406: 57.15,35.56 57.78,36.2 v59.69,38.1 | IC2.10 21.59,45.72 21.27,45.72 C3.2 19.36,45.41 v19.05,45.72 | C5.2 67,29.85 IC3.2 v64.78,27.95 v64.77,27.94 | C6.2 v38.1,21.59 | C7.2 v38.73,1.91 | C8.2 v48.9,1.91 | C9.2 v59.05,1.91 | IC6.4 v54.61,3.81 | IC7.4 v64.77,3.81 | IC5.4 v44.45,3.81
  Top 0.61: C4.- 40.62,51.45 v40.64,51.44 40.64,53.34 v42.55,53.34 | v59.69,38.1 C2.2
  pour Bottom (isolate 0.254): 0,55.88 85.09,55.88 85.09,0 0,0
IN+
  Top 0.254: IC5.8 40.64,13.34 40.01,13.97 37.47,13.97 36.83,13.34 IN+.TP 34.92,11.43 33.66,10.16 R17.1 31.33,8.69 R16.2
IN-
  Top 0.254: IC5.7 41.91,10.16 40.64,8.89 39.37,7.62 IN-.TP 34.92,7.62 34.29,6.99 31.33,6.99 R16.1 31.11,5.29 R18.1
LINKIN_B  (via drill 0.6)
  Top 0.254: 41.91,19.05 41.91,19.68 41.27,20.32 37.47,20.32 36.83,20.95 36.2,21.59 34.29,21.59 33.66,20.95 33.66,16.51 31.11,13.97 18.41,13.97 17.78,13.34 v17.78,3.81 IN.TP | 41.91,19.05 IC4.2 | 44.45,18.41 43.81,19.05 41.91,19.05 | v41.91,8.89 IC5.2
  Top 0.305: IC4.4 44.45,18.41
  Bottom 0.254: v17.78,3.81 17.78,13.34 18.41,13.97 31.11,13.97 31.75,13.34 31.75,11.43 32.38,10.79 37.47,10.79 39.37,8.89 40.01,8.26 41.27,8.26 v41.91,8.89
LINKOUT_B  (via drill 0.6)
  Top 0.254: IC4.14 v48.26,25.4 | v35.56,20.32 34.92,20.32 34.29,19.68 34.29,15.88 31.75,13.34 20.95,13.34 20.32,12.7 v20.32,3.81 OUT.TP | v43.18,7.62 IC5.3
  Bottom 0.254: v48.26,25.4 48.26,24.13 45.72,21.59 40.64,21.59 39.37,20.32 v35.56,20.32 | v20.32,3.81 20.32,12.7 20.64,13.02 20.95,13.34 30.48,13.34 31.11,12.7 31.11,10.79 31.75,10.16 37.47,10.16 38.73,8.89 40.01,7.62 v43.18,7.62
LINKRESET  (via drill 0.6)
  Top 0.254: 52.07,29.21 52.07,28.57 IC4.11 | 52.07,29.21 v53.34,29.21 52.07,29.21 | 52.07,29.21 50.16,29.21 49.53,28.57 IC4.13
  Top 0.305: IC2.8 24.13,41.27 23.5,40.64 23.5,31.11 24.13,30.48 v33.02,30.48
  Bottom 0.305: v33.02,30.48 34.29,29.21 36.83,29.21 38.1,27.94 41.27,27.94 42.55,29.21 v53.34,29.21
LINKRESET_B
  Top 0.254: 50.8,14.61 50.16,13.97 36.2,13.97 35.56,13.97 34.92,13.97 33.02,12.06 26.04,12.06 25.4,11.43 25.4,3.81 RST.TP | 50.8,14.61 IC4.9 | IC7.3 63.5,9.53 62.87,10.16 59.69,10.16 59.05,10.79 59.05,13.34 58.42,13.97 51.44,13.97 50.8,14.61
LINKSPEED  (via drill 0.6)
  Top 0.254: IC2.5 27.94,45.09 v28.57,45.72 | IC1.17 54.61,44.45 v53.98,45.09 52.7,46.35 52.7,49.53 54.61,52.07 62.87,52.07 63.38,51.55 63.38,49.65 DS4.A
  Bottom 0.254: v28.57,45.72 30.48,47.62 36.2,47.62 36.83,46.99 39.37,46.99 40.64,45.72 48.9,45.72 49.53,45.09 v53.98,45.09
N$1
  Top 0.254: IC2.18 R1.1
N$2
  Top 0.254: R2.2 S1.6 8.89,34.92 9.53,35.56 15.88,35.56 16.51,34.92 IC2.15
N$3
  Top 0.406: IC1.27 C1.2
N$4
  Top 0.254: R3.2 S1.5 6.35,35.56 6.99,36.2 17.14,36.2 17.78,35.56 IC2.16
N$5
  Top 0.254: R4.2 S1.4 3.81,36.2 4.45,36.83 18.41,36.83 19.05,36.2 IC2.17
N$6
  Top 0.254: T2.B 44.45,49.38 44.45,48.9 45.09,48.26 45.72,48.26 46.35,47.62 46.35,46.99 46.35,45.72 45.72,45.09 43.81,45.09 43.18,44.45 IC1.26
N$7  (via drill 0.6)
  Top 0.254: T1.B 47.31,54.29 48.26,53.34 48.26,50.8 46.99,49.53 46.99,44.45 v46.35,43.81 | IC1.4 44.45,32.38 45.09,31.75 48.26,31.75 v48.9,32.38
  Bottom 0.254: v46.35,43.81 46.35,38.73 48.9,36.2 48.9,33.02 v48.9,32.38
N$8
  Top 0.254: DS7.C R13.2
N$9
  Top 0.254: DS8.C R14.2
N$10
  Top 0.254: IC4.12 50.8,26.04 51.44,25.4 56.52,25.4 57.15,24.77 DS7.A
N$11
  Top 0.305: DS1.C R7.2
N$12
  Top 0.305: DS2.C 67.42,48.15 67.94,47.62 67.94,43.18 68.58,42.55 69,42.55 R8.2
N$13
  Top 0.305: DS3.C 65.52,48.15 66.67,46.99 R9.2
N$14
  Top 0.305: DS4.C 63.62,48.15 64.14,47.62 R10.2
N$15
  Top 0.305: DS5.C 61.71,48.15 62.87,46.99 62.87,43.18 63.5,42.55 63.92,42.55 R11.2
N$16
  Top 0.305: DS6.C 59.69,47.62 60.33,46.99 61.17,46.99 R12.2
N$17
  Top 0.254: DS8.A 46.24,24.25 45.72,24.77 IC4.16
N$19  (via drill 0.6)
  Top 0.254: DS9.A 58.53,24.25 v58.42,24.13 | v48.26,15.24 IC4.7
  Bottom 0.254: v58.42,24.13 49.53,24.13 48.26,22.86 v48.26,15.24
N$20
  Top 0.254: DS9.C R15.2
OUT+
  Top 0.254: IC5.5 44.45,12.7 45.09,13.34 46.35,13.34 46.99,12.7 OUT+.TP
OUT-
  Top 0.254: IC5.6 43.18,9.53 44.45,8.26 46.35,8.26 OUT-.TP
R!W  (via drill 0.6)
  Top 0.254: IC2.1 33.02,43.81 v33.66,44.45 | v43.18,33.02 IC1.3
  Bottom 0.254: v33.66,44.45 34.29,44.45 34.92,43.81 36.83,43.81 37.47,44.45 39.37,44.45 40.64,43.18 42.55,43.18 43.18,42.55 43.18,36.2 v43.18,33.02
RESET+
  Top 0.254: IC7.5 64.77,12.7 65.41,13.34 66.67,13.34 67.31,12.7 RST+.TP
RESET-
  Top 0.254: IC7.6 63.5,10.16 64.77,8.89 66.04,7.62 RST-.TP
RS0  (via drill 0.6)
  Top 0.254: IC2.2 v31.75,44.45 | v45.72,33.02 IC1.5
  Bottom 0.254: v31.75,44.45 32.38,45.09 33.02,45.72 34.29,45.72 34.92,45.09 35.56,44.45 36.83,44.45 37.47,45.09 39.37,45.09 40.64,43.81 43.18,43.81 43.81,43.18 43.81,38.73 45.72,36.83 45.72,36.2 v45.72,33.02
RS1  (via drill 0.6)
  Top 0.254: IC2.3 30.48,45.09 31.11,45.72 v35.56,45.72 | v46.99,33.02 IC1.6
  Bottom 0.254: v35.56,45.72 39.37,45.72 40.64,44.45 43.18,44.45 43.81,43.81 44.45,43.18 44.45,38.73 46.99,36.2 v46.99,33.02
RXD  (via drill 0.6)
  Top 0.254: X1.10 10.79,52.07 3.81,52.07 3.17,51.44 v3.17,47.62 | v4.45,21.59 RX.TP
  Bottom 0.254: v3.17,47.62 3.17,46.35 1.91,45.09 1.91,27.3 3.17,26.04 3.17,22.86 v4.45,21.59
SCL
  Top 0.254: X1.5 6.99,48.9 7.62,48.26 17.14,48.26 17.78,47.62 17.78,45.72 19.05,44.45 IC2.12
SDA
  Top 0.254: X1.3 4.45,48.26 5.08,47.62 16.51,47.62 17.14,46.99 17.14,45.72 17.78,45.09 IC2.13
STATUS  (via drill 0.6)
  Top 0.254: IC2.7 v25.4,45.72 | DS3.A 65.41,52.07 64.77,52.7 53.98,52.7 51.44,49.53 v50.16,49.53
  Bottom 0.254: v25.4,45.72 28.57,48.9 39.37,48.9 40.64,50.16 49.53,50.16 v50.16,49.53
TXD  (via drill 0.6)
  Top 0.254: v7.62,46.35 2.54,46.35 v1.91,46.99 | v1.91,26.04 2.54,25.4 TX.TP
  Bottom 0.254: X1.8 8.26,52.07 8.26,46.99 v7.62,46.35 | v1.91,46.99 1.27,46.35 1.27,26.67 v1.91,26.04

### Text on the board
tPlace: RPi Transputer Link Adapter | v2.22 isquared.nl 2014 | gnd | buffered link | RS-422 link
tNames: 3V3 | 5V | SPD | STS | /CS | INT | ACT | PWR | FDX | LNK | 100 | i²c | address | A2 | A0 | Link | Activity | In | Out | Rst | Tx | Rx | Gnd | Console | in+ | out+ | clk+ | rst+ | in- | out- | clk- | rst- | Link In | Link Out | Clock | Reset | Gnd